# Altium schematic sheet External_Board_3mode.SchDoc: External Board Mode 3 - I2C
size A4; DrawnBy: Anne Moller; Organization: Altium Limited; Address1: L3, 12a Rodborough Rd; Address2: Frenchs Forest; Address3: NSW; Address4: Australia 2086; Revision: 1.0.0; SheetNumber: 1; SheetTotal: 1
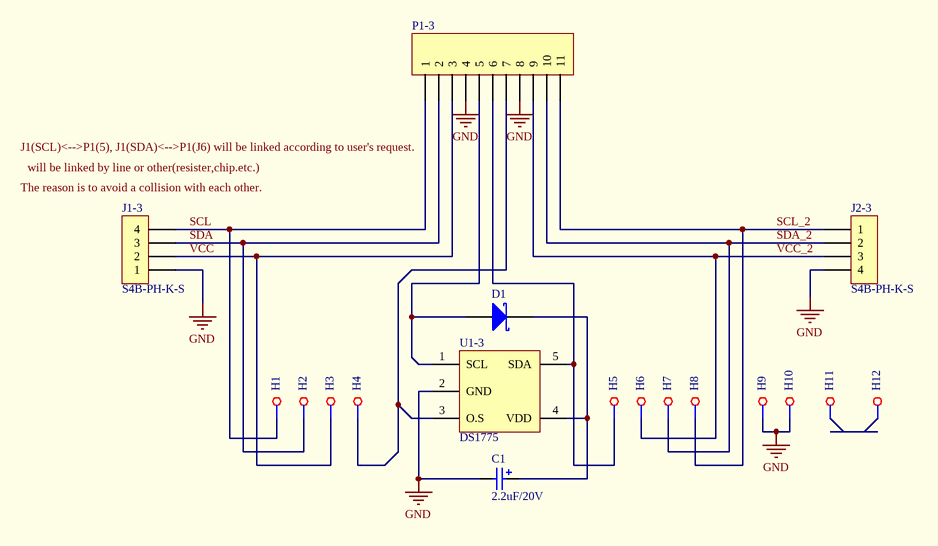
[diagram p0: External_Board_3mode.SchDoc]

## Parts
C1  2.2uF/20V  [C1206]
D1  MSS2P2-M3/89A  [MSS2P2-M3]  (value not drawn)
H1  TP_HOLE  [TestHole]  (value not drawn)
H2  TP_HOLE  [TestHole]  (value not drawn)
H3  TP_HOLE  [TestHole]  (value not drawn)
H4  TP_HOLE  [TestHole]  (value not drawn)
H5  TP_HOLE  [TestHole]  (value not drawn)
H6  TP_HOLE  [TestHole]  (value not drawn)
H7  TP_HOLE  [TestHole]  (value not drawn)
H8  TP_HOLE  [TestHole]  (value not drawn)
H9  TP_HOLE  [TestHole]  (value not drawn)
H10  TP_HOLE  [TestHole]  (value not drawn)
H11  TP_HOLE  [TestHole]  (value not drawn)
H12  TP_HOLE  [TestHole]  (value not drawn)
J1-3  S4B-PH-K-S  [CON4]
J2-3  S4B-PH-K-S  [CON4]
P1-3  Header11  [CON11]  (value not drawn)
U1-3  DS1775  [DS1775]

## Nets
GND: C1.2 H9.1(TP) H10.1(TP) J1-3.1 J2-3.4 P1-3.4 P1-3.8 U1-3.2(GND)
SCL: H1.1(TP) J1-3.4 P1-3.1
SCL_2: H8.1(TP) J2-3.1 P1-3.11
SDA: H2.1(TP) J1-3.3 P1-3.2
SDA_2: H7.1(TP) J2-3.2 P1-3.10
VCC: H3.1(TP) J1-3.2 P1-3.3
VCC_2: H6.1(TP) J2-3.3 P1-3.9
NetC1_1: C1.1 D1.2(K) U1-3.4(VDD)
NetD1_1: D1.1(A) P1-3.5 U1-3.1(SCL)
NetH4_1: H4.1(TP) P1-3.7 U1-3.3(O.S)
NetH5_1: H5.1(TP) P1-3.6 U1-3.5(SDA)

Not connected (* = marked no-connect by the designer): H11 1(TP); H12 1(TP)

## Notes on the sheet
- Labels drawn without touching a wire or pin: J1(SCL)<-->P1(5), J1(SDA)<-->P1(J6) will be linked according to user's request., The reason is to avoid a collision with each other., will be linked by line or other(resister,chip.etc.)
- Title
- Size:
- Date:
- A4
- Number:
- Time:
- Revision:
- Sheet
- of
- Drawn by:
- File:

## Library data of the parts
C1 = TAJA225K020RNJ: CAP TANT 2.2UF 20V 10% 1206; Manufacturer: AVX Corporation; Manufacturer Size Code: A; Capacitance: 2.2µF; ESR (Equivalent Series Resistance): 5.3 Ohm; Type: Molded; Supplier 1: Digi-Key; Manufacturer Part Number: TAJA225K020RNJ; RoHS: RoHS Compliant; Category: Capacitors; Stock 1: 864; Pricing 1: 1=0.35, 10=0.295, 100=0.1476, 250=0.11072, 500=0.09778, 1000=0.08672 (USD); Packaging: Digi-Reel®; Tolerance: ±10%; Voltage - Rated: 20V; Operating Temperature: -55°C ~ 125°C; Mounting Type: Surface Mount; Package / Case: 1206 (3216 Metric); Size / Dimension: 0.126" L x 0.063" W (3.20mm x 1.60mm); Height - Seated (Max): 0.071" (1.80mm); Lead Spacing: -; Features: General Purpose; Lifetime @ Temp.: -; ComponentLink1URL: http://datasheets.avx.com/TAJ.pdf; ComponentLink1Description: http://datasheets.avx.com/TAJ.pdf
D1 = MSS2P2-M3/89A: DIODE SCHOTTKY 20V 2A MICROSMP; Manufacturer: Vishay Semiconductor Diodes Division; Voltage - Forward (Vf) (Max) @ If: 600mV @ 2A; Speed: Fast Recovery =< 500ns, > 200mA (Io); Current - Reverse Leakage @ Vr: 250µA @ 20V; Capacitance @ Vr, F: 65pF @ 4V, 1MHz; Supplier 1: Digi-Key; Manufacturer Part Number: MSS2P2-M3/89A; RoHS: RoHS Compliant; Category: Discrete Semiconductor Products; Stock 1: 16161; Pricing 1: 1=0.37, 10=0.274, 100=0.1552, 500=0.1029, 1000=0.07892 (USD); Packaging: Cut Tape (CT); Diode Type: Schottky; Voltage - DC Reverse (Vr) (Max): 20V; Current - Average Rectified (Io): 2A; Reverse Recovery Time (trr): -; Mounting Type: Surface Mount; Package / Case: MicroSMP; Supplier Device Package: MicroSMP; Operating Temperature - Junction: -55°C ~ 150°C; ComponentLink1URL: http://www.vishay.com/docs/89054/mss2p3.pdf; ComponentLink1Description: http://www.vishay.com/docs/89054/mss2p3.pdf
H1-H12 = TP_HOLE: TEST POINT HOLE
J1-3 J2-3 = S4B-PH-K-S (LF)(SN): JST (JAPAN SOLDERLESS TERMINALS) - S4B-PH-K-S (LF)(SN) - CONNECTOR, HEADER, 2MM, 4 POSITION, 1ROW; Supplier 1: Newark; Manufacturer: JST (JAPAN SOLDERLESS TERMINALS); Manufacturer Part Number: S4B-PH-K-S (LF)(SN); RoHS: YES; Stock 1: 908; Pricing 1: 1=0.14, 250=0.126, 500=0.112, 1000=0.101, 5000=0.069 (USD); ComponentLink1URL: http://www.farnell.com/datasheets/80564.pdf; ComponentLink1Description: http://www.farnell.com/datasheets/80564.pdf
P1-3 = SFH11-PBPC-D10-ST-BK: CONN HEADR FMALE 20POS .1" DL AU; Manufacturer: Sullins Connector Solutions; Connector Type: Header; Number of Positions: 20; Number of Positions Loaded: All; Pitch: 0.100" (2.54mm); Supplier 1: Digi-Key; Manufacturer Part Number: SFH11-PBPC-D10-ST-BK; RoHS: RoHS Compliant; Category: Connectors, Interconnects; Stock 1: 14457; Pricing 1: 1=1.43, 10=1.185, 25=1.0976, 50=0.9878, 100=0.878, 250=0.76824, 500=0.7024, 1000=0.63655, 2500=0.5707 (USD); Packaging: Tray; Contact Type: Female Socket; Number of Rows: 2; Row Spacing: 0.100" (2.54mm); Mounting Type: Through Hole; Termination: Solder; Fastening Type: -; Features: Polarizing Key; Contact Finish: Gold; Contact Finish Thickness: Flash; Color: Black; ComponentLink1URL: http://sullinscorp.com/catalogs/146_PAGE119_.100_SFH11_SERIES_FEMALE_HDR_ST_RA.pdf; ComponentLink1Description: http://sullinscorp.com/catalogs/146_PAGE119_.100_SFH11_SERIES_FEMALE_HDR_ST_RA.pdf
U1-3 = DS1775R4+T&R: SENSOR TEMPERATURE I2C SOT23-5; Manufacturer: Maxim Integrated; Sensor Type: Digital, Local; Sensing Temperature - Local: -55°C ~ 125°C; Output Type: I²C; Voltage - Supply: 2.7 V ~ 5.5 V; Resolution: 11 b; Accuracy - Highest (Lowest): ±2°C (±3°C); Test Condition: 10°C ~ 85°C (-55°C ~ 125°C); Supplier 1: Digi-Key; Manufacturer Part Number: DS1775R4+T&R; RoHS: RoHS Compliant; Category: Sensors, Transducers; Stock 1: 5995; Pricing 1: 1=2.14, 10=2.015, 25=1.6116, 50=1.531, 100=1.4102, 250=1.33764, 500=1.28928 (USD); Packaging: Cut Tape (CT); Sensing Temperature - Remote: -; Features: Output Switch, Programmable Limit, Programmable Resolution, Shutdown Mode; Operating Temperature: -55°C ~ 125°C; Package / Case: SC-74A, SOT-753; Supplier Device Package: SOT-23-5; ComponentLink1URL: http://datasheets.maximintegrated.com/en/ds/DS1775-DS1775R.pdf; ComponentLink1Description: http://datasheets.maximintegrated.com/en/ds/DS1775-DS1775R.pdf